# EAGLE schematic underdesk_macropad_pins (EAGLE 7.7.0)
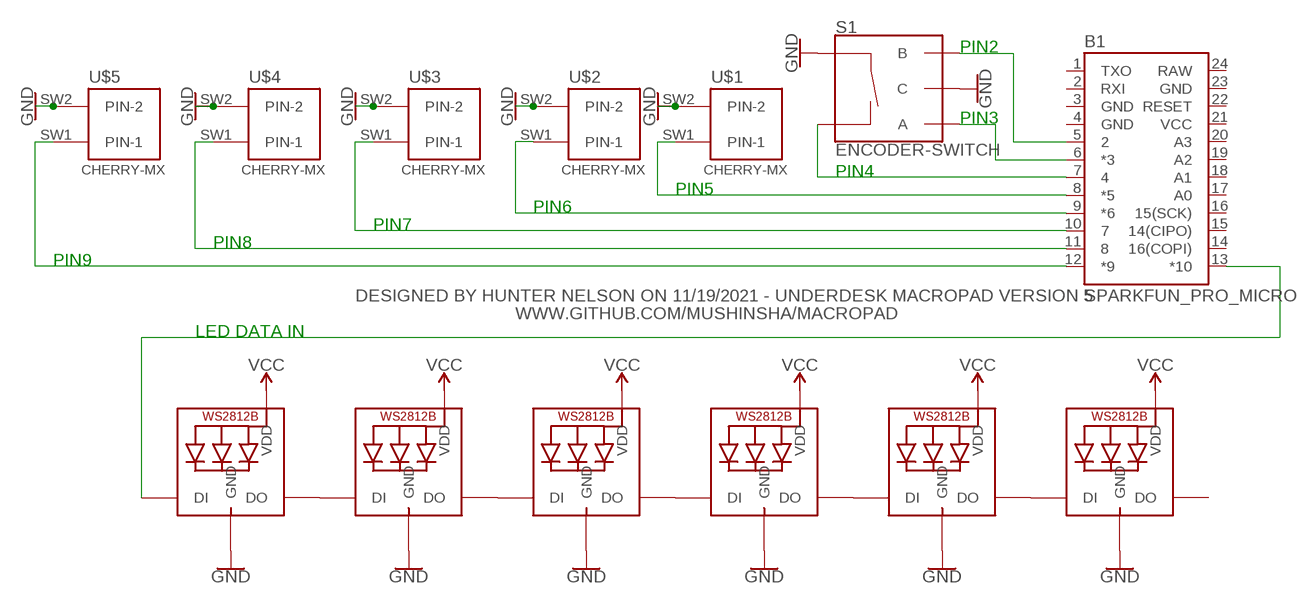
[diagram p0: schematic, sheet 1]

## Parts
B1  SPARKFUN_PRO_MICRO  [SPARKFUN_PRO_MICRO]
LED1  WS2812B5050  [WS2812B]
LED2  WS2812B5050  [WS2812B]
LED3  WS2812B5050  [WS2812B]
LED4  WS2812B5050  [WS2812B]
LED5  WS2812B5050  [WS2812B]
LED6  WS2812B5050  [WS2812B]
S1  ENCODER-SWITCH  [ROTARY_ENC_PLAIN]
U$1  CHERRY-MX  [CHERRY-MX]
U$2  CHERRY-MX  [CHERRY-MX]
U$3  CHERRY-MX  [CHERRY-MX]
U$4  CHERRY-MX  [CHERRY-MX]
U$5  CHERRY-MX  [CHERRY-MX]

## Nets
GND: LED1.3-GND(GND) LED2.3-GND(GND) LED3.3-GND(GND) LED4.3-GND(GND) LED5.3-GND(GND) LED6.3-GND(GND) S1.C S1.SW+ U$1.SW2(PIN-2) U$2.SW2(PIN-2) U$3.SW2(PIN-2) U$4.SW2(PIN-2) U$5.SW2(PIN-2)
N$1: LED1.2-DOUT(DO) LED2.4-DIN(DI)
N$2: LED2.2-DOUT(DO) LED3.4-DIN(DI)
N$3: LED3.2-DOUT(DO) LED4.4-DIN(DI)
N$4: LED4.2-DOUT(DO) LED5.4-DIN(DI)
N$6: B1.13(*10) LED1.4-DIN(DI)
N$9: B1.5 S1.B
N$10: B1.6(*3) S1.A
N$11: B1.7 S1.SW-
N$12: B1.8(*5) U$1.SW1(PIN-1)
N$13: B1.9(*6) U$2.SW1(PIN-1)
N$14: B1.10 U$3.SW1(PIN-1)
N$15: B1.11 U$4.SW1(PIN-1)
N$16: B1.12(*9) U$5.SW1(PIN-1)
N$18: LED5.2-DOUT(DO) LED6.4-DIN(DI)
Unconnected: B1.1(TXO) B1.2(RXI) B1.14(16(COPI)) B1.15(14(CIPO)) B1.16(15(SCK)) B1.17(A0) B1.18(A1) B1.19(A2) B1.20(A3) B1.22(RESET) LED6.2-DOUT(DO)

## Notes on the sheet
- PIN2
- PIN3
- PIN4
- PIN5
- PIN6
- PIN7
- PIN8
- PIN9
- DESIGNED BY HUNTER NELSON ON 11/19/2021 - UNDERDESK MACROPAD VERSION 5
- WWW.GITHUB.COM/MUSHINSHA/MACROPAD
- LED DATA IN

## Power pins joined to a net without a drawn wire
GND: B1.3(GND) B1.4(GND) B1.23(GND)
RAW: B1.24(RAW)
VCC: B1.21(VCC)
VDD: LED1.1-VDD(VDD) LED2.1-VDD(VDD) LED3.1-VDD(VDD) LED4.1-VDD(VDD) LED5.1-VDD(VDD) LED6.1-VDD(VDD)

## Library data of the parts
B1 = SparkFun-Boards:SPARKFUN_PRO_MICRO: SparkFun Pro Micro Atmega32U4 compatible footprint. SparkFun Products: 3.3V/8MHz <https://www.sparkfun.com/products/12587> 5V/16MHz <https://www.sparkfun.com/products/12640>
LED1-LED6 = adafruit:WS2812B
S1 = SparkFun-Switches:ENCODER-SWITCH: Rotary Encoder w/ Select Switch Encoders rotate similarly to potentiometers, but they’re different from potentiometers in that an encoder has full rotation without limits. They output gray code so that you can tell how much and in which direction the encoder has been turned. This encoder includes a push-down select switch built into the shaft. SparkFun Products Rotary Encoder <https://www.sparkfun.com/products/9117> (COM-09117); SF_SKU: COM-09117
U$1-U$5 = cherrymx:CHERRY-MX: Cherry MX series keyswitch